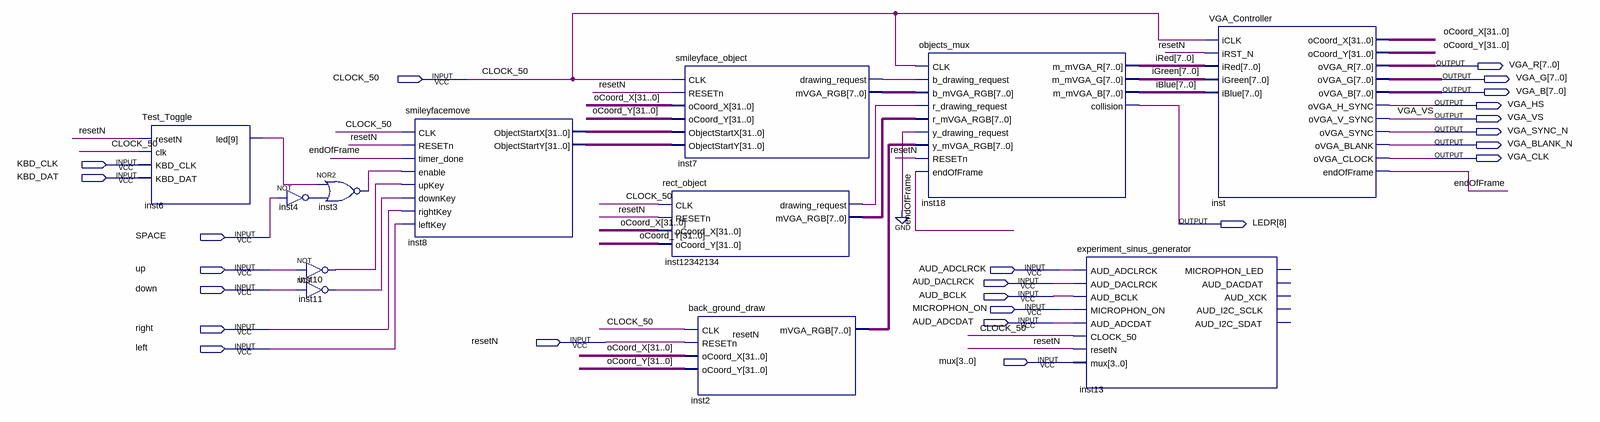
[diagram p0: schematic sheet]
// Quartus schematic TOP_SIFTACH.bdf as structural Verilog: 12 symbols, 24 pins
module TOP_SIFTACH (
  input  CLOCK_50,
  input  KBD_CLK,
  input  KBD_DAT,
  input  SPACE,
  input  up,
  input  AUD_ADCLRCK,
  input  AUD_DACLRCK,
  input  down,
  input  AUD_BCLK,
  input  MICROPHON_ON,
  input  AUD_ADCDAT,
  input  right,
  input  resetN,
  input  left,
  input  [3:0] mux,
  output [7:0] VGA_R,
  output [7:0] VGA_G,
  output [7:0] VGA_B,
  output VGA_HS,
  output VGA_VS,
  output VGA_SYNC_N,
  output VGA_BLANK_N,
  output VGA_CLK,
  output [8:8] LEDR
);

  wire endOfFrame, inst3_out, inst4_out, inst6_led, inst7_drawing_request, inst10_out, inst11_out,
       inst12342134_drawing_request;
  wire [7:0] iBlue, iGreen, inst2_mvga_rgb, inst7_mvga_rgb, inst12342134_mvga_rgb, iRed;
  wire [31:0] inst8_objectstartx, inst8_objectstarty, oCoord_X, oCoord_Y;

  Test_Toggle inst6 (.resetN(resetN), .clk(CLOCK_50), .KBD_CLK(KBD_CLK), .KBD_DAT(KBD_DAT), .led(inst6_led));
  nor inst3 (inst3_out, inst6_led, inst4_out);
  not inst4 (inst4_out, SPACE);
  not inst10 (inst10_out, up);
  not inst11 (inst11_out, down);
  smileyfacemove inst8 (
    .CLK(CLOCK_50), .RESETn(resetN), .timer_done(endOfFrame), .enable(inst3_out), .upKey(inst10_out),
    .downKey(inst11_out), .rightKey(right), .leftKey(left), .ObjectStartX(inst8_objectstartx),
    .ObjectStartY(inst8_objectstarty));
  smileyface_object inst7 (
    .CLK(CLOCK_50), .RESETn(resetN), .oCoord_X(oCoord_X), .oCoord_Y(oCoord_Y),
    .ObjectStartX(inst8_objectstartx), .ObjectStartY(inst8_objectstarty),
    .drawing_request(inst7_drawing_request), .mVGA_RGB(inst7_mvga_rgb));
  rect_object inst12342134 (
    .CLK(CLOCK_50), .RESETn(resetN), .oCoord_X(oCoord_X), .oCoord_Y(oCoord_Y),
    .drawing_request(inst12342134_drawing_request), .mVGA_RGB(inst12342134_mvga_rgb));
  back_ground_draw inst2 (
    .CLK(CLOCK_50), .RESETn(resetN), .oCoord_X(oCoord_X), .oCoord_Y(oCoord_Y), .mVGA_RGB(inst2_mvga_rgb));
  objects_mux inst18 (
    .CLK(CLOCK_50), .b_drawing_request(inst7_drawing_request), .b_mVGA_RGB(inst7_mvga_rgb),
    .r_drawing_request(inst12342134_drawing_request), .r_mVGA_RGB(inst12342134_mvga_rgb),
    .y_drawing_request(1'b0), .y_mVGA_RGB(inst2_mvga_rgb), .RESETn(resetN), .endOfFrame(endOfFrame),
    .m_mVGA_R(iRed), .m_mVGA_G(iGreen), .m_mVGA_B(iBlue), .collision(LEDR[8]));
  experiment_sinus_generator inst13 (
    .AUD_ADCLRCK(AUD_ADCLRCK), .AUD_DACLRCK(AUD_DACLRCK), .AUD_BCLK(AUD_BCLK), .MICROPHON_ON(MICROPHON_ON),
    .AUD_ADCDAT(AUD_ADCDAT), .CLOCK_50(CLOCK_50), .resetN(resetN), .mux(mux));  // open: MICROPHON_LED, AUD_DACDAT, AUD_XCK, AUD_I2C_SCLK, AUD_I2C_SDAT
  VGA_Controller inst (
    .iCLK(CLOCK_50), .iRST_N(resetN), .iRed(iRed), .iGreen(iGreen), .iBlue(iBlue), .oCoord_X(oCoord_X),
    .oCoord_Y(oCoord_Y), .oVGA_R(VGA_R), .oVGA_G(VGA_G), .oVGA_B(VGA_B), .oVGA_H_SYNC(VGA_HS),
    .oVGA_V_SYNC(VGA_VS), .oVGA_SYNC(VGA_SYNC_N), .oVGA_BLANK(VGA_BLANK_N), .oVGA_CLOCK(VGA_CLK),
    .endOfFrame(endOfFrame));
endmodule
